# EAGLE board DrumidySynth (EAGLE 9.6.2), part 1 of 2
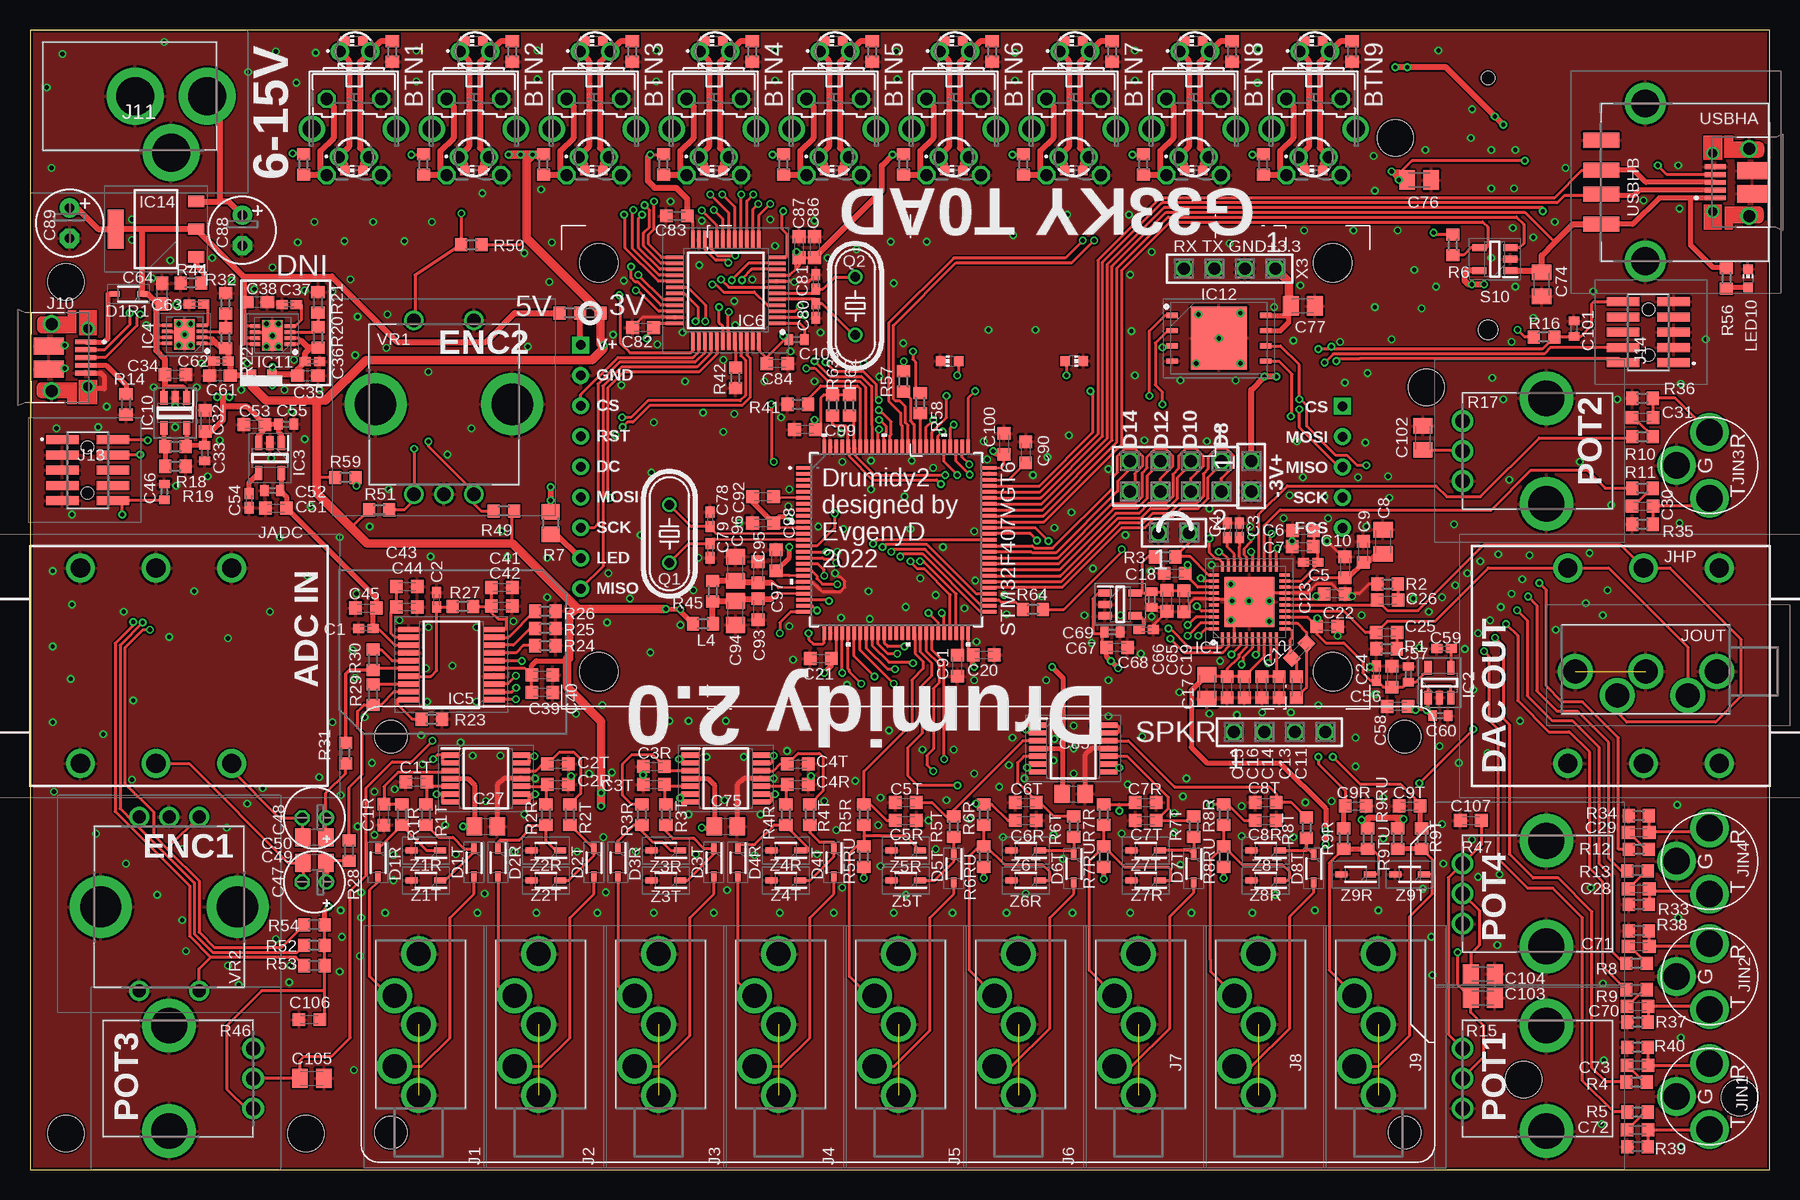
[diagram p6: board, top side]
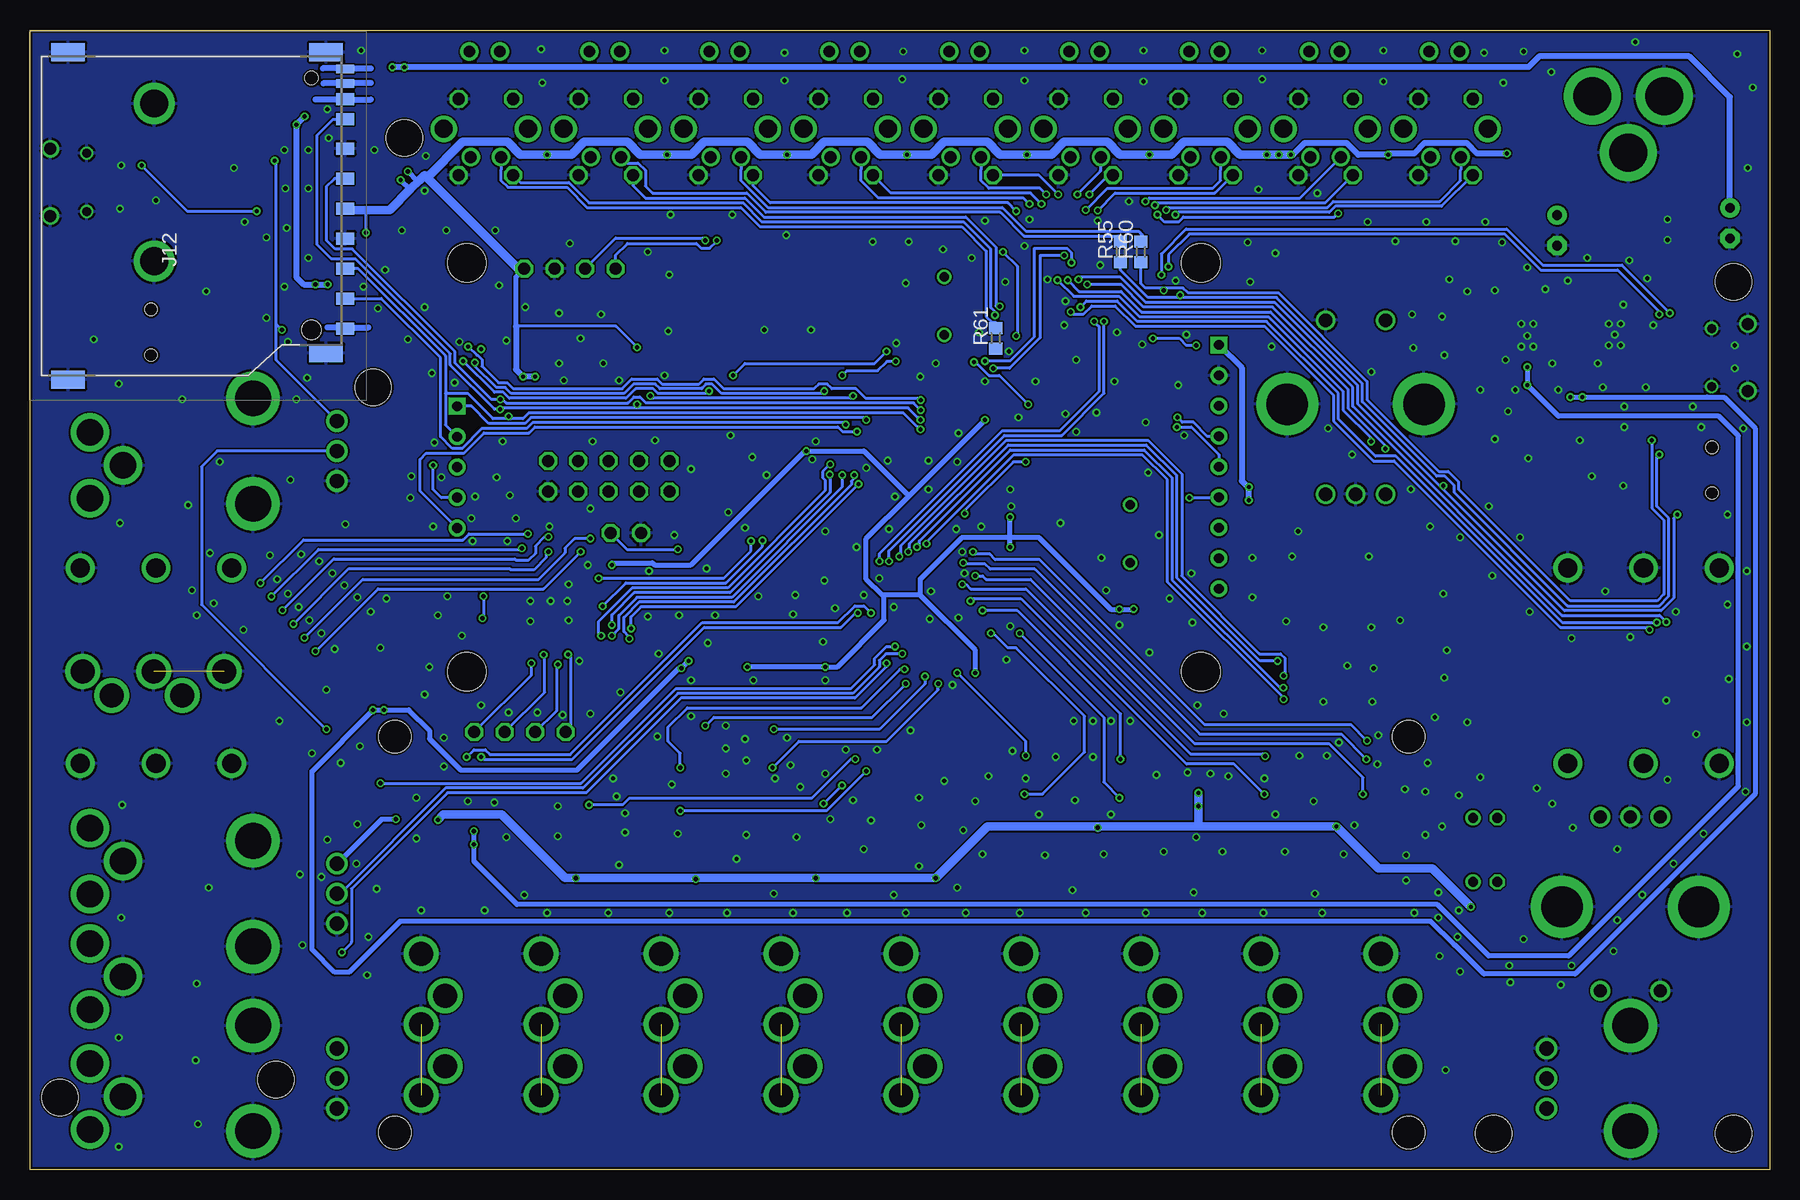
[diagram p7: board, bottom side, seen from below]

Size 145 x 95 mm. Coordinates in mm from the lower left corner, seen from the top.
Outline: 0,0 145,0 145,95 0,95 0,0
Copper layers (1*16): Top 0.018mm / dielectric 1.55mm / Bottom 0.018mm
Design rules "Multi-CB_2L_100µm-Tracks_OL35µmEVG *": minimum track width 0.1mm, minimum drill 0.2mm, track to track 0.15mm, track to pad 0.15mm, pad to pad 0.15mm, via to via 0.15mm, smd to smd 0mil, copper to edge 0.2mm, drill to drill 0.2mm, minimum pad ring 0.15mm, minimum via ring 0.15mm, stop-mask expansion 2mil, vias tented up to drill 0.45mm, thermal gap 0.2mm
Holes 3 mm at 3,3 23,3 142.5,6 124.5,7.5 116.4,65.2 113.8,86 3,74

## Footprints (pad centres in the part's own frame; a part is rotated, then mirrored left to right if it is on the bottom)
B3F-31XX = drill 1.016 octagon: A1 -2.261,-1.245; A2 -2.261,5.105; B1 2.261,-1.245; B2 2.261,5.105 | drill 1.499 pad 2.159: G1 -3.505,1.245; G2 3.505,1.245
C0402K = smd 0.925 x 0.74: 1 -0.6,0; 2 0.6,0
C0603K = smd 1.05 x 1.08: 1 -0.875,0; 2 0.875,0
C0805K = smd 1.3 x 1.6: 1 -1,0; 2 1,0
C0805 = smd 1.3 x 1.5: 1 -0.95,0; 2 0.95,0
C0402 = smd 0.7 x 0.9: 1 -0.65,0; 2 0.65,0
C0603 = smd 1.1 x 1: 1 -0.85,0; 2 0.85,0
E2-5 = drill 0.813 pad 1.27: + -1.016,0 | drill 0.813 pad 1.27 octagon: - 1.016,0
E2,5-6 = drill 0.813 pad 1.6: + -1.27,0 | drill 0.813 pad 1.6 octagon: - 1.27,0
SODFL2512X80N = smd 0.84 x 0.46: 1 -1.15,0; 2 1.15,0
QFN50P600X600X100-41N = smd 0.85 x 0.25: 1 -2.95,2.25; 2 -2.95,1.75; 3 -2.95,1.25; 4 -2.95,0.75; 5 -2.95,0.25; 6 -2.95,-0.25; 7 -2.95,-0.75; 8 -2.95,-1.25; 9 -2.95,-1.75; 10 -2.95,-2.25; 21 2.95,-2.25; 22 2.95,-1.75; 23 2.95,-1.25; 24 2.95,-0.75; 25 2.95,-0.25; 26 2.95,0.25; 27 2.95,0.75; 28 2.95,1.25; 29 2.95,1.75; 30 2.95,2.25 | smd 0.25 x 0.85: 11 -2.25,-2.95; 12 -1.75,-2.95; 13 -1.25,-2.95; 14 -0.75,-2.95; 15 -0.25,-2.95; 16 0.25,-2.95; 17 0.75,-2.95; 18 1.25,-2.95; 19 1.75,-2.95; 20 2.25,-2.95; 31 2.25,2.95; 32 1.75,2.95; 33 1.25,2.95; 34 0.75,2.95; 35 0.25,2.95; 36 -0.25,2.95; 37 -0.75,2.95; 38 -1.25,2.95; 39 -1.75,2.95; 40 -2.25,2.95 | smd 4.15 x 4.15: 41 0,0
SOT95P280X145-5N = smd 1.15 x 0.6: 1 -1.25,0.95; 2 -1.25,0; 3 -1.25,-0.95; 4 1.25,-0.95; 5 1.25,0.95
SON50P300X300X80-9N = smd 0.85 x 0.3: 1 -1.45,0.75; 2 -1.45,0.25; 3 -1.45,-0.25; 4 -1.45,-0.75; 5 1.45,-0.75; 6 1.45,-0.25; 7 1.45,0.25; 8 1.45,0.75 | smd 1.7 x 2.54: 9 0,0
SOP65P780X200-20N = smd 1.8 x 0.45: 1 -3.55,2.925; 2 -3.55,2.275; 3 -3.55,1.625; 4 -3.55,0.975; 5 -3.55,0.325; 6 -3.55,-0.325; 7 -3.55,-0.975; 8 -3.55,-1.625; 9 -3.55,-2.275; 10 -3.55,-2.925; 11 3.55,-2.925; 12 3.55,-2.275; 13 3.55,-1.625; 14 3.55,-0.975; 15 3.55,-0.325; 16 3.55,0.325; 17 3.55,0.975; 18 3.55,1.625; 19 3.55,2.275; 20 3.55,2.925
QFP50P900X900X160-48N = smd 1.475 x 0.3: 1 -4.238,2.75; 2 -4.238,2.25; 3 -4.238,1.75; 4 -4.238,1.25; 5 -4.238,0.75; 6 -4.238,0.25; 7 -4.238,-0.25; 8 -4.238,-0.75; 9 -4.238,-1.25; 10 -4.238,-1.75; 11 -4.238,-2.25; 12 -4.238,-2.75; 25 4.238,-2.75; 26 4.238,-2.25; 27 4.238,-1.75; 28 4.238,-1.25; 29 4.238,-0.75; 30 4.238,-0.25; 31 4.238,0.25; 32 4.238,0.75; 33 4.238,1.25; 34 4.238,1.75; 35 4.238,2.25; 36 4.238,2.75 | smd 0.3 x 1.475: 13 -2.75,-4.238; 14 -2.25,-4.238; 15 -1.75,-4.238; 16 -1.25,-4.238; 17 -0.75,-4.238; 18 -0.25,-4.238; 19 0.25,-4.238; 20 0.75,-4.238; 21 1.25,-4.238; 22 1.75,-4.238; 23 2.25,-4.238; 24 2.75,-4.238; 37 2.75,4.238; 38 2.25,4.238; 39 1.75,4.238; 40 1.25,4.238; 41 0.75,4.238; 42 0.25,4.238; 43 -0.25,4.238; 44 -0.75,4.238; 45 -1.25,4.238; 46 -1.75,4.238; 47 -2.25,4.238; 48 -2.75,4.238
SOP65P640X120-14N = smd 1.475 x 0.45: 1 -2.938,1.95; 2 -2.938,1.3; 3 -2.938,0.65; 4 -2.938,0; 5 -2.938,-0.65; 6 -2.938,-1.3; 7 -2.938,-1.95; 8 2.938,-1.95; 9 2.938,-1.3; 10 2.938,-0.65; 11 2.938,0; 12 2.938,0.65; 13 2.938,1.3; 14 2.938,1.95
SOT95P280X100-5N = smd 1.15 x 0.6: 1 -1.25,0.95; 2 -1.25,0; 3 -1.25,-0.95; 4 1.25,-0.95; 5 1.25,0.95
SON127P800X600X80-9N = smd 0.95 x 0.45: 1 -3.9,1.905; 2 -3.9,0.635; 3 -3.9,-0.635; 4 -3.9,-1.905; 5 3.9,-1.905; 6 3.9,-0.635; 7 3.9,0.635; 8 3.9,1.905 | smd 4.7 x 5.25: 9 0,0
SOT230P700X180-4N = smd 1.35 x 0.95: 1 -3.35,2.3; 2 -3.35,0; 3 -3.35,-2.3 | smd 1.35 x 3.25: 4 3.35,0
35RAPC2AVN4 = drill 2 pad 2.8: 1 6.096,5.588; 2 8.496,7.588; 3 14.396,7.588; 4 17.896,5.588; 5 11.996,5.588
AMPHENOL_10103594-0001LF = smd 0.4 x 1.75: 1 -1.3,2.825; 2 -0.65,2.825; 3 0,2.825; 4 0.65,2.825; 5 1.3,2.825 | drill 0.75 pad 1.05: 6 -2.425,3.03; 7 2.425,3.03 | drill 1: 8 -2.8,0; 9 2.8,0 | smd 1.425 x 2.5: S1 -0.963,-0.25; S2 0.963,-0.25
PRT00119 = drill 3.162 pad 4.743: 1 -5.664,-1.286; 2 0.336,-1.286; 3 -2.664,3.414
GSD090012SEU = smd 1 x 1.5: 1 6.875,12.275; 2 4.375,12.275; 3 1.875,12.275; 4 -0.625,12.275; 5 -3.125,12.275; 6 -5.625,12.275; 7 -8.05,12.275; 8 -9.75,12.275; 9 9.375,12.275 | smd 0.7 x 1.5: 10 -11.05,12.275; 11 -12.25,12.275 | smd 1.5 x 2.8: MP1 -13.65,10.675; MP2 11.451,10.675; MP3 -13.65,-10.825; MP4 13.65,-10.825 | hole 1.1: -11.499,9.475 | hole 1.6: 9.501,9.475
FTSH-105-XX-YYY-DV-K-A-P-TR = smd 0.74 x 2.7: 1 -2.54,-2.1; 2 -2.54,2.1; 3 -1.27,-2.1; 4 -1.27,2.1; 5 0,-2.1; 6 0,2.1; 7 1.27,-2.1; 8 1.27,2.1; 9 2.54,-2.1; 10 2.54,2.1 | hole 1.02: -1.905,0; 1.905,0
SJ63073E = drill 1.6 pad 2.4: 1 -6.3,-8.15; 2 0,-8.15; 3 6.3,-8.15; 4 -6.3,8.15; 5 0,8.15; 6 6.3,8.15
JACK35VERT = drill 2.2 pad 3.2: GND 0,2.75; RING 2.75,0; TIP -2.75,0
R0603 = smd 1 x 1.1: 1 -0.85,0; 2 0.85,0
CHIP-LED0603 = smd 0.8 x 0.8: A 0,-0.75; C 0,0.75
T-1(3MM)_2 = drill 0.98 pad 1.54: 1 -1.27,0; 2 1.27,0
HC49/S = drill 0.813: 1 -2.413,0; 2 2.413,0
R0805 = smd 1.3 x 1.5: 1 -0.95,0; 2 0.95,0
PTV09A4020FB103 = drill 1.2 pad 1.8: 1 -2.5,-5.6; 2 0,-5.6; 3 2.5,-5.6 | drill 2.973 pad 4.46: 4 -4.4,1.4; 5 4.4,1.4
SOT95P280X145-5N' = smd 1.15 x 0.6: 1 -1.3,0.95; 2 -1.3,0; 3 -1.3,-0.95; 4 1.3,-0.95; 5 1.3,0.95
LQFP100-14X14MM = smd 1.194 x 0.305: 1 -7.75,6; 2 -7.75,5.5; 3 -7.75,5; 4 -7.75,4.5; 5 -7.75,4; 6 -7.75,3.5; 7 -7.75,3; 8 -7.75,2.5; 9 -7.75,2; 10 -7.75,1.5; 11 -7.75,1; 12 -7.75,0.5; 13 -7.75,0; 14 -7.75,-0.5; 15 -7.75,-1; 16 -7.75,-1.5; 17 -7.75,-2; 18 -7.75,-2.5; 19 -7.75,-3; 20 -7.75,-3.5; 21 -7.75,-4; 22 -7.75,-4.5; 23 -7.75,-5; 24 -7.75,-5.5; 25 -7.75,-6; 51 7.75,-6; 52 7.75,-5.5; 53 7.75,-5; 54 7.75,-4.5; 55 7.75,-4; 56 7.75,-3.5; 57 7.75,-3; 58 7.75,-2.5; 59 7.75,-2; 60 7.75,-1.5; 61 7.75,-1; 62 7.75,-0.5; 63 7.75,0; 64 7.75,0.5; 65 7.75,1; 66 7.75,1.5; 67 7.75,2; 68 7.75,2.5; 69 7.75,3; 70 7.75,3.5; 71 7.75,4; 72 7.75,4.5; 73 7.75,5; 74 7.75,5.5; 75 7.75,6 | smd 0.305 x 1.194: 26 -6,-7.75; 27 -5.5,-7.75; 28 -5,-7.75; 29 -4.5,-7.75; 30 -4,-7.75; 31 -3.5,-7.75; 32 -3,-7.75; 33 -2.5,-7.75; 34 -2,-7.75; 35 -1.5,-7.75; 36 -1,-7.75; 37 -0.5,-7.75; 38 0,-7.75; 39 0.5,-7.75; 40 1,-7.75; 41 1.5,-7.75; 42 2,-7.75; 43 2.5,-7.75; 44 3,-7.75; 45 3.5,-7.75; 46 4,-7.75; 47 4.5,-7.75; 48 5,-7.75; 49 5.5,-7.75; 50 6,-7.75; 76 6,7.75; 77 5.5,7.75; 78 5,7.75; 79 4.5,7.75; 80 4,7.75; 81 3.5,7.75; 82 3,7.75; 83 2.5,7.75; 84 2,7.75; 85 1.5,7.75; 86 1,7.75; 87 0.5,7.75; 88 0,7.75; 89 -0.5,7.75; 90 -1,7.75; 91 -1.5,7.75; 92 -2,7.75; 93 -2.5,7.75; 94 -3,7.75; 95 -3.5,7.75; 96 -4,7.75; 97 -4.5,7.75; 98 -5,7.75; 99 -5.5,7.75; 100 -6,7.75
JUMPERWIDE = smd 0.8 x 1: P$1 -1.37,0; P$2 0.37,0
TFTQVGA = drill 0.8 pad 1.4: CS 65.7,14.94; CS_F 2.2,25.12; DC 65.7,20.02; GND 65.7,12.4; LED 65.7,27.64; MISO 65.7,30.18; MISO_SD 2.2,20.04; MOSI 65.7,22.56; MOSI_SD 2.2,17.5; RST 65.7,17.48; SCK 65.7,25.1; SCK_SD 2.2,22.58 | drill 0.8 pad 1.4 square: CS_SD 2.2,14.96; VDD 65.7,9.86 | hole 3.2: 3,3; 3,37.1; 64.2,3; 64.2,37.1
EPAPERLCDNOPIN = hole 2.7: 2.5,2.5; 2.5,35.5; 87,2.5; 87,35.5
2923037 = smd 3 x 1.25: 1 6.23,3.5; 2 6.23,1; 3 6.23,-1; 4 6.23,-3.5 | drill 2.3 pad 3.45: 5 2.55,6.57; 6 2.55,-6.57
PEC11R4220FS0024 = drill 1.1 pad 1.65: 1 0,0; 2 5,0; A1 0,-14.5; B1 5,-14.5; C1 2.5,-14.5 | drill 3.441 pad 5.161: MH1 -3.2,-7; MH2 8.2,-7
SSW-104-02-G-S = drill 1 pad 1.5 octagon: 1 -3.81,0; 2 -1.27,0; 3 1.27,0; 4 3.81,0
SSW-102-02-G-S = drill 1 pad 1.5 octagon: 1 -1.27,0; 2 1.27,0
SSW-104-02-G-D = drill 1 pad 1.5 octagon: 1 -3.81,-1.27; 2 -3.81,1.27; 3 -1.27,-1.27; 4 -1.27,1.27; 5 1.27,-1.27; 6 1.27,1.27; 7 3.81,-1.27; 8 3.81,1.27
SOD2512X110N = smd 1 x 0.5: 1 -1.2,0; 2 1.2,0

## Placement (x,y rotation side)
BTN1  [B3F-31XX]  27,88 180 top
BTN2  [B3F-31XX]  37,88 180 top
BTN3  [B3F-31XX]  47,88 180 top
BTN4  [B3F-31XX]  57,88 180 top
BTN5  [B3F-31XX]  67,88 180 top
BTN6  [B3F-31XX]  77,88 180 top
BTN7  [B3F-31XX]  87,88 180 top
BTN8  [B3F-31XX]  97,88 180 top
BTN9  [B3F-31XX]  107,88 180 top
C1  10n  [C0402K]  28,45.1 180 top
C1R  10n  [C0603K]  29.5,29.6 270 top
C1T  10n  [C0603K]  32.2,32.3 180 top
C2  10n  [C0402K]  33.9,47.5 90 top
C2R  10n  [C0603K]  44,32.1 0 top
C2T  10n  [C0603K]  44,33.8 0 top
C3  150pF  [C0402K]  100.8,53.3 90 top
C3R  10n  [C0603K]  52,33.6 180 top
C3T  10n  [C0603K]  52,32.1 180 top
C4  150pF  [C0402K]  99.8,53.3 90 top
C4R  10n  [C0603K]  64,32.1 0 top
C4T  10n  [C0603K]  64,33.8 0 top
C5  10n  [C0402K]  106.76,50.63 180 top
C5R  10n  [C0603K]  73,29.1 0 top
C5T  10n  [C0603K]  73,30.6 180 top
C6  100n  [C0603K]  106.14,53.29 180 top
C6R  10n  [C0603K]  83,29.1 0 top
C6T  10n  [C0603K]  83,30.6 180 top
C7  1u  [C0603K]  106.09,51.93 180 top
C7R  10n  [C0603K]  93,30.6 0 top
C7T  10n  [C0603K]  93,29.1 180 top
C8  10u  [C0805K]  112.79,52.34 90 top
C8R  10n  [C0603K]  103,29.1 0 top
C8T  10n  [C0603K]  103,30.6 180 top
C9  1u  [C0603K]  111.13,51.5 90 top
C9R  10n  [C0603K]  110.5,30.3 0 top
C9T  10n  [C0603K]  115,30.3 180 top
C10  100n  [C0603K]  109.61,50.22 90 top
C11  1u  [C0603K]  105.57,40.22 270 top
C12  1u  [C0603K]  105.79,43.25 45 top
C13  1u  [C0603K]  104.12,40.22 270 top
C14  100n  [C0603K]  102.68,40.22 270 top
C15  100n  [C0603K]  99.79,40.22 270 top
C16  100n  [C0603K]  101.23,40.22 270 top
C17  10u  [C0805K]  98.11,40.25 270 top
C18  100n  [C0603K]  95.4,49.71 180 top
C19  100n  [C0603K]  96.19,47.38 270 top
C20  100n  [C0603K]  79.5,42.9 0 top
C21  100n  [C0603K]  65.9,42.6 180 top
C22  100n  [C0603K]  108.14,45.29 0 top
C23  100n  [C0603K]  108.76,47.99 0 top
C24  10n  [C0402K]  112.23,41.38 90 top
C25  22n  [C0603K]  113.07,44.77 0 top
C26  22n  [C0603K]  113.16,47.47 0 top
C27  100n  [C0805]  38,28.6 0 top
C28  1u  [C0603K]  134.1,23.4 0 top
C29  1u  [C0603K]  134.1,28.1 0 top
C30  1u  [C0603K]  134.4,55.3 0 top
C31  1u  [C0603K]  134.4,62.7 0 top
C32  4u7  [C0603K]  14.61,62.42 270 top
C33  100n  [C0402]  14.57,59.72 90 top
C34  4u7  [C0603K]  12.11,66.29 180 top
C35  10u  [C0603]  23.15,66.18 0 top
C36  100n  [C0402K]  23.55,67.35 0 top
C37  4n7  [C0402K]  21.61,72.1 180 top
C38  10uF  [C0603]  18.94,72.32 0 top
C39  100n  [C0603K]  42.7,39.79 0 top
C40  10u  [C0603K]  42.7,41.23 0 top
C41  100n  [C0603K]  39.33,48.52 0 top
C42  10u  [C0603K]  39.33,46.98 0 top
C43  100n  [C0603K]  31.4,48.6 0 top
C44  10u  [C0603K]  31.4,46.9 0 top
C45  100n  [C0603K]  28,46.8 180 top
C46  0.1uF  [C0402]  11.2,56.5 90 top
C47  [E2-5]  23.7,23.97 180 top
C48  [E2-5]  23.7,29.32 180 top
C49  10u  [C0805]  23.7,25.58 180 top
C50  10u  [C0805]  23.7,27.68 180 top
C51  4u7  [C0603K]  20.5,55.13 0 top
C52  100n  [C0402]  20.2,56.6 0 top
C53  4u7  [C0603K]  18.7,62.12 0 top
C54  10n  [C0402K]  18.26,55.77 90 top
C55  100n  [C0402]  21.35,62.14 180 top
C56  4u7  [C0603K]  113.53,41.09 270 top
C57  100n  [C0402]  114.9,41.29 270 top
C58  4u7  [C0603K]  114.01,38.62 0 top
C59  10n  [C0402K]  117.87,43.43 0 top
C60  100n  [C0402]  117.55,37.83 180 top
C61  10u  [C0603]  15.83,66.17 180 top
C62  100n  [C0402K]  15.93,67.4 180 top
C63  4n7  [C0402K]  13.89,72.15 180 top
C64  10uF  [C0603]  11.03,73.02 90 top
C65  4u7  [C0603K]  94.78,47.41 90 top
C66  100n  [C0402]  93.51,47.51 90 top
C67  4u7  [C0603K]  90.61,43.54 180 top
C68  DNI  [C0402K]  93.06,45.03 180 top
C69  100n  [C0402]  90.21,44.81 180 top
C70  1u  [C0603K]  134,13.6 0 top
C71  1u  [C0603K]  134.1,18.6 0 top
C72  1u  [C0603K]  134,3.3 0 top
C73  1u  [C0603K]  134,8.7 0 top
C74  10u  [C0805K]  126,73.8 270 top
C75  100n  [C0805]  58,28.6 0 top
C76  2u2  [C0805K]  115.8,82.5 0 top
C77  2u2  [C0805K]  106.1,72 0 top
C78  20p  [C0402K]  56.7,54.2 90 top
C79  20p  [C0402K]  56.7,51.6 270 top
C80  20p  [C0402K]  65.5,71.6 270 top
C81  20p  [C0402K]  65.5,74 90 top
C82  100n  [C0603K]  51.1,70.2 180 top
C83  100n  [C0603K]  53.9,79.5 180 top
C84  100n  [C0603K]  62.3,67.2 180 top
C85  100n  [C0805]  87,31.3 0 top
C86  100n  [C0603K]  65.4,76.9 270 top
C87  100n  [C0603K]  64.1,76.9 270 top
C88  10u  [E2,5-6]  17.7,78.3 270 top
C89  100u  [E2,5-6]  3.3,78.9 270 top
C90  2u2  [C0603K]  83,59.8 270 top
C91  2u2  [C0603K]  77.3,42 90 top
C92  100nF  [C0603K]  61.1,56.1 0 top
C93  100n  [C0603K]  60.7,46.7 270 top
C94  1u  [C0805K]  58.8,46.4 270 top
C95  100n  [C0603K]  60.7,49.8 90 top
C96  1u  [C0805K]  58.8,50.1 90 top
C97  100n  [C0603K]  62.2,50.8 90 top
C98  100n  [C0603K]  61.1,53.9 180 top
C99  100n  [C0603K]  64.6,61.7 180 top
C100  100n  [C0603K]  81.2,60.5 90 top
C101  0.1uF  [C0402]  128.7,70.1 90 top
C102  2u2  [C0805K]  116.1,61 90 top
C103  2u2  [C0805K]  121.1,14.3 0 top
C104  2u2  [C0805K]  121.1,16.3 0 top
C105  2u2  [C0805K]  23.5,7.6 0 top
C106  100n  [C0603K]  23.3,12.5 0 top
C107  100n  [C0603K]  120.1,29.1 0 top
C108  0.1uF  [C0402]  63.9,69.2 0 top
D1R  BAT54J,115  [SODFL2512X80N]  29,25.6 270 top
D1R1  BAT54J,115  [SODFL2512X80N]  8.2,73 180 top
D1T  BAT54J,115  [SODFL2512X80N]  37,25.6 270 top
D2R  BAT54J,115  [SODFL2512X80N]  39,25.6 270 top
D2T  BAT54J,115  [SODFL2512X80N]  47,25.6 270 top
D3R  BAT54J,115  [SODFL2512X80N]  49,25.6 270 top
D3T  BAT54J,115  [SODFL2512X80N]  57,25.6 270 top
D4R  BAT54J,115  [SODFL2512X80N]  59,25.6 270 top
D4T  BAT54J,115  [SODFL2512X80N]  67,25.6 270 top
D5T  BAT54J,115  [SODFL2512X80N]  77,25.1 270 top
D6T  BAT54J,115  [SODFL2512X80N]  87,25.1 270 top
D7T  BAT54J,115  [SODFL2512X80N]  97,25.1 270 top
D8T  BAT54J,115  [SODFL2512X80N]  107,25.1 270 top
IC1  CS43L22-CNZR  [QFN50P600X600X100-41N]  101.64,47.31 90 top
IC2  LD3985M25R  [SOT95P280X145-5N]  117.49,40.59 90 top
IC3  LD3985M33R  [SOT95P280X145-5N]  20,59.31 270 top
IC4  ADM7170ACPZ-3.3-R7  [SON50P300X300X80-9N]  12.89,69.61 180 top
IC5  WM8782SEDS_RV  [SOP65P780X200-20N]  35.13,42.1 180 top
IC6  STM32F103C8T6TR  [QFP50P900X900X160-48N]  58,73.3 180 top
IC7  MCP6004-I_ST  [SOP65P640X120-14N]  38,32.6 0 top
IC8  TPS76925DBVR  [SOT95P280X145-5N]  90.87,47.11 0 top
IC9  MCP6004-I_ST  [SOP65P640X120-14N]  58,32.6 0 top
IC10  ADP123AUJZ-R7  [SOT95P280X100-5N]  12.11,63.08 270 top
IC11  ADM7170ACPZ-3.3-R7  [SON50P300X300X80-9N]  20.21,69.56 180 top
IC12  W25Q512JVEIQ  [SON127P800X600X80-9N]  99.1,69.3 0 top
IC13  MCP6004-I_ST  [SOP65P640X120-14N]  86.95,35.1 0 top
IC14  LT1117IST  [SOT230P700X180-4N]  10.5,78.4 180 top
J1  [35RAPC2AVN4]  38,0.1 90 top
J2  [35RAPC2AVN4]  48,0.1 90 top
J3  [35RAPC2AVN4]  58,0.1 90 top
J4  [35RAPC2AVN4]  68,0.1 90 top
J5  [35RAPC2AVN4]  78,0.1 90 top
J6  [35RAPC2AVN4]  88,0.1 90 top
J7  [35RAPC2AVN4]  98,0.1 90 top
J8  [35RAPC2AVN4]  108,0.1 90 top
J9  [35RAPC2AVN4]  118,0.1 90 top
J10  10103594-0001LF  [AMPHENOL_10103594-0001LF]  1.8,67.7 270 top
J11  DC-JACK  [PRT00119]  9.1,88.2 180 top
J12  GSD090012SEU  [GSD090012SEU]  131,79.5 270 bottom
J13  FTSH-105-01-F-DV-K-A-P-TR  [FTSH-105-XX-YYY-DV-K-A-P-TR]  4.8,58.3 270 top
J14  FTSH-105-01-F-DV-K-A-P-TR  [FTSH-105-XX-YYY-DV-K-A-P-TR]  134.9,69.8 90 top
JADC  SJ-63073E  [SJ63073E]  10.5,42 0 top
JHP  [35RAPC2AVN4]  146.7,47.1 180 top
JIN1  JACK35VERT  [JACK35VERT]  140,6.1 90 top
JIN2  JACK35VERT  [JACK35VERT]  140,16.1 90 top
JIN3  JACK35VERT  [JACK35VERT]  140,58.7 90 top
JIN4  JACK35VERT  [JACK35VERT]  140,25.7 90 top
JOUT  SJ-63073E  [SJ63073E]  134.5,42 180 top
L4  fcm1608-0603  [R0603]  56.1,45.5 180 top
LED10  [CHIP-LED0603]  143.2,74.3 0 top
LED11  [CHIP-LED0603]  76.65,67.4 90 top
LED12  [CHIP-LED0603]  87.05,67.4 270 top
LEDA1  L-934HD  [T-1(3MM)_2]  27.1,93.2 0 top
LEDA3  L-934HD  [T-1(3MM)_2]  37.1,93.2 0 top
LEDA5  L-934HD  [T-1(3MM)_2]  47.1,93.2 0 top
LEDA7  L-934HD  [T-1(3MM)_2]  57.1,93.2 0 top
LEDA9  L-934HD  [T-1(3MM)_2]  67.1,93.2 0 top
LEDA11  L-934HD  [T-1(3MM)_2]  77.1,93.2 0 top
LEDA13  L-934HD  [T-1(3MM)_2]  87.1,93.2 0 top
LEDA15  L-934HD  [T-1(3MM)_2]  97.1,93.2 0 top
LEDA17  L-934HD  [T-1(3MM)_2]  107.1,93.2 0 top
LEDB1  [CHIP-LED0603]  27,94.1 90 top
LEDB3  [CHIP-LED0603]  37,94.1 90 top
LEDB5  [CHIP-LED0603]  47,94.1 90 top
LEDB7  [CHIP-LED0603]  57,94.1 90 top
LEDB9  [CHIP-LED0603]  67,94.1 90 top
LEDB11  [CHIP-LED0603]  77,94.1 90 top
LEDB13  [CHIP-LED0603]  87,94.1 90 top
LEDB15  [CHIP-LED0603]  97,94.1 90 top
LEDB17  [CHIP-LED0603]  107,94.1 90 top
LEDC1  L-934HD  [T-1(3MM)_2]  27,84.4 0 top
LEDC3  L-934HD  [T-1(3MM)_2]  37,84.4 0 top
LEDC5  L-934HD  [T-1(3MM)_2]  47,84.4 0 top
LEDC7  L-934HD  [T-1(3MM)_2]  57,84.4 0 top
LEDC9  L-934HD  [T-1(3MM)_2]  67,84.4 0 top
LEDC11  L-934HD  [T-1(3MM)_2]  77,84.4 0 top
LEDC13  L-934HD  [T-1(3MM)_2]  87,84.4 0 top
LEDC15  L-934HD  [T-1(3MM)_2]  97,84.4 0 top
LEDC17  L-934HD  [T-1(3MM)_2]  107,84.4 0 top
LEDD1  [CHIP-LED0603]  27,83.3 90 top
LEDD3  [CHIP-LED0603]  37,83.3 90 top
LEDD5  [CHIP-LED0603]  47,83.3 90 top
LEDD7  [CHIP-LED0603]  57,83.3 90 top
LEDD9  [CHIP-LED0603]  67,83.3 90 top
LEDD11  [CHIP-LED0603]  77,83.3 90 top
LEDD13  [CHIP-LED0603]  87,83.3 90 top
LEDD15  [CHIP-LED0603]  97,83.3 90 top
LEDD17  [CHIP-LED0603]  107,83.3 90 top
Q1  [HC49/S]  53.3,53 90 top
Q2  [HC49/S]  68.8,72 270 top
R1  51  [R0603]  113.07,43.41 0 top
R1R  1k  [R0603]  31,29.6 270 top
R1T  1k  [R0603]  33,29.6 270 top
R2  51  [R0603]  113.16,48.81 0 top
R2R  1k  [R0603]  43,29.6 270 top
R2T  1k  [R0603]  45,29.6 270 top
R3  10k  [R0603]  94.62,51.09 180 top
R3R  1k  [R0603]  51,29.6 270 top
R3T  1k  [R0603]  53,29.6 270 top
R4  100  [R0603]  133.9,7.3 180 top
R4R  1k  [R0603]  63,29.6 270 top
R4T  1k  [R0603]  65,29.6 270 top
R5  100  [R0603]  134,4.8 180 top
R5R  1k  [R0603]  69.5,29.6 270 top
R5RU  10k  [R0603]  69.5,26.1 90 top
R5T  1k  [R0603]  77,28.6 270 top
R6  10k  [R0603]  118.6,77.1 270 top
R6R  1k  [R0603]  79.5,29.6 270 top
R6RU  10k  [R0603]  79.5,26.1 90 top
R6T  1k  [R0603]  87,28.6 270 top
R7  [R0805]  43.4,53.9 270 top
R7R  1k  [R0603]  89.5,29.6 270 top
R7RU  10k  [R0603]  89.5,26.1 90 top
R7T  1k  [R0603]  97,28.6 270 top
R8  100  [R0603]  133.9,17.2 180 top
R8R  1k  [R0603]  99.5,29.6 270 top
R8RU  10k  [R0603]  99.5,26.1 90 top
R8T  1k  [R0603]  106.4,28.5 270 top
R9  100  [R0603]  133.9,15 180 top
R9R  1k  [R0603]  109.5,27.6 270 top
R9RU  10k  [R0603]  111.5,27.6 270 top
R9T  1k  [R0603]  116,27.6 270 top
R9TU  10k  [R0603]  114,27.6 270 top
R10  100  [R0603]  134.4,61.1 180 top
R11  100  [R0603]  134.4,56.8 180 top
R12  100  [R0603]  134.1,26.7 180 top
R13  100  [R0603]  134,24.9 180 top
R14  10k  [R0603]  8,63.8 90 top
R15  PTV09A-4025U-B103  [PTV09A4020FB103]  125,7.6 270 top
R16  10k  [R0603]  126.2,69.4 180 top
R17  PTV09A-4025U-B103  [PTV09A4020FB103]  125,59.9 270 top
R18  150k  [R0603]  12.14,60.27 180 top
R19  21k  [R0603]  12.11,58.63 0 top
R20  0k  [R0603]  24.02,69.36 90 top
R21  DNI  [R0603]  24,72.28 90 top
R22  0k  [R0603]  16.3,69.31 90 top
R23  10k  [R0603]  33.49,37.55 0 top
R24  DNI  [R0603]  42.95,43.67 180 top
R25  0k  [R0603]  42.95,45.11 180 top
R26  DNI  [R0603]  42.95,46.55 180 top
R27  3k3  [R0603]  36.07,46.95 0 top
R28  10k  [R0603]  26.6,26.6 90 top
R29  10k  [R0603]  28.6,39.6 90 top
R30  10k  [R0603]  28.6,42.5 270 top
R31  10k  [R0603]  26.3,34.7 90 top
R32  DNI  [R0603]  16.3,72.2 90 top
R33  100k  [R0603]  134.1,22.1 0 top
R34  100k  [R0603]  134.1,29.5 0 top
R35  100k  [R0603]  134.4,53.8 0 top
R36  100k  [R0603]  134.4,64.3 0 top
R37  100k  [R0603]  134,12.3 0 top
R38  100k  [R0603]  134.1,19.9 0 top
R39  100k  [R0603]  134,1.9 0 top
R40  100k  [R0603]  134,10.2 0 top
R41  10k  [R0603]  64,63.8 180 top
R42  10k  [R0603]  58.8,66 90 top
R43  3V3  [R0603]  46.7,71.4 180 top
R44  0k  [R0603]  13.4,73.9 0 top
R45  47E  [R0603]  56.9,48.2 90 top
R46  PTV09A-4025U-B103  [PTV09A4020FB103]  13,7.6 90 top
R47  PTV09A-4025U-B103  [PTV09A4020FB103]  125,23 270 top
R48  5V  [R0603]  45,71.4 0 top
R49  10k  [R0603]  39.5,54.9 180 top
R50  10k  [R0603]  36.8,77.1 180 top
R51  10k  [R0603]  29.1,55 0 top
R52  10k  [R0603]  23.7,18.7 180 top
R53  10k  [R0603]  23.7,17 180 top
R54  10k  [R0603]  23.7,20.4 180 top
R55  0  [R0603]  54.1,76.5 90 bottom
R56  10k  [R0603]  141.4,74.3 270 top
R57  10k  [R0603]  72.8,65.7 90 top
R58  10k  [R0603]  74.2,63.9 90 top
R59  10k  [R0603]  26.3,57.7 180 top
R60  0  [R0603]  52.4,76.5 90 bottom
R61  0  [R0603]  64.5,69.3 90 bottom
R62  10k  [R0603]  68.3,63.7 270 top
R63  10k  [R0603]  66.9,63.7 270 top
R64  0  [R0603]  83.6,46.7 180 top
RBTN1  10k  [R0603]  22.8,83.8 270 top
RBTN3  10k  [R0603]  32.8,83.8 270 top
RBTN5  10k  [R0603]  42.8,83.8 270 top
RBTN7  10k  [R0603]  52.8,83.8 270 top
RBTN9  10k  [R0603]  62.8,83.8 270 top
RBTN11  10k  [R0603]  72.8,83.8 270 top
RBTN13  10k  [R0603]  82.8,83.8 270 top
RBTN15  10k  [R0603]  92.8,83.8 270 top
RBTN17  10k  [R0603]  102.8,83.8 270 top
RLED1  1k  [R0603]  30.2,93.2 270 top
RLED3  1k  [R0603]  40.2,93.2 270 top
RLED5  1k  [R0603]  50.2,93.2 270 top
RLED7  1k  [R0603]  60.2,93.2 270 top
RLED9  1k  [R0603]  70.2,93.2 270 top
RLED11  1k  [R0603]  80.2,93.2 270 top
RLED13  1k  [R0603]  90.2,93.2 270 top
RLED15  1k  [R0603]  100.2,93.2 270 top
RLED17  1k  [R0603]  110.2,93.2 270 top
S10  STMPS2141STR  [SOT95P280X145-5N']  122.1,75.9 180 top
U1  STM32F407VGT6  [LQFP100-14X14MM]  72.2,52.5 0 top
U$1  JUMPERSMD  [JUMPERWIDE]  19.81,66.17 0 top
U$2  TFT-SD  [TFTQVGA]  111.6,78.6 180 top
U$3  EPAPER2.9  [EPAPERLCDNOPIN]  117.1,38.6 180 top
USBHA  10103594-0001LF  [AMPHENOL_10103594-0001LF]  143.3,82.3 90 top
USBHB  USB-A(292303-7)  [2923037]  137.2,82.3 180 top
VR1  PEC11R-4220F-S0024  [PEC11R4220FS0024]  32,70.8 0 top
VR2  PEC11R-4220F-S0024  [PEC11R4220FS0024]  14.1,14.9 180 top
X1  SSW-104-02-G-S  [SSW-104-02-G-S]  104.15,36.46 0 top
X2  SSW-102-02-G-S  [SSW-102-02-G-S]  95.35,53.08 0 top
X3  SSW-104-02-G-S  [SSW-104-02-G-S]  100,75.1 180 top
X4  SSW-104-02-G-D  [SSW-104-02-G-D]  95.5,57.8 180 top
X5  SSW-102-02-G-S  [SSW-102-02-G-S]  101.8,57.8 270 top
Z1R  MM3Z3V3T1G  [SOD2512X110N]  33,26.6 180 top
Z1T  MM3Z3V3T1G  [SOD2512X110N]  33,24.1 180 top
Z2R  MM3Z3V3T1G  [SOD2512X110N]  43,26.6 180 top
Z2T  MM3Z3V3T1G  [SOD2512X110N]  43,24.1 180 top
Z3R  MM3Z3V3T1G  [SOD2512X110N]  53,26.6 180 top
Z3T  MM3Z3V3T1G  [SOD2512X110N]  53,24.1 180 top
Z4R  MM3Z3V3T1G  [SOD2512X110N]  63,26.6 180 top
Z4T  MM3Z3V3T1G  [SOD2512X110N]  63,24.1 180 top
Z5R  MM3Z3V3T1G  [SOD2512X110N]  73,26.6 180 top
Z5T  MM3Z3V3T1G  [SOD2512X110N]  73,24.1 180 top
Z6R  MM3Z3V3T1G  [SOD2512X110N]  83,24.1 180 top
Z6T  MM3Z3V3T1G  [SOD2512X110N]  83,26.6 180 top
Z7R  MM3Z3V3T1G  [SOD2512X110N]  93,24.1 180 top
Z7T  MM3Z3V3T1G  [SOD2512X110N]  93,26.6 180 top
Z8R  MM3Z3V3T1G  [SOD2512X110N]  103,24.1 180 top
Z8T  MM3Z3V3T1G  [SOD2512X110N]  103,26.6 180 top
Z9R  MM3Z3V3T1G  [SOD2512X110N]  110.5,24.6 180 top
Z9T  MM3Z3V3T1G  [SOD2512X110N]  115,24.6 180 top

## Tracks (layer width: path | path; a pad name or v marks a point on that pad's centre or on a via)
2V5A  (via drill 0.35)
  Top 0.25: IC1.16 107.45,47.56 C23.1 107.69,47.8 v107.2,47.8 | IC1.13 106.5,46.06 107.23,45.33 | 107.23,45.33 C22.1 107.27,44.63 108,43.9 109.5,43.9 111.1,42.3 111.1,41.4 111.72,40.78 C24.1 112.8,40.22 C56.2 114.47,40.22 C57.2 115.54,40.64 116.54,41.64 IC2.5 | v107.3,45.96 107.23,45.89 107.23,45.33
  Bottom 0.25: v107.2,47.8 107.2,46.06 v107.3,45.96
2V5D
  Top 0.25: IC8.5 92.7,48.06 | 92.7,48.06 93.41,48.06 C66.2 94.66,48.16 C65.2 96.16,48.28 C19.1 96.39,48.06 IC1.34 | R3.2 93.19,51.09 92.7,50.6 92.7,48.06
3V3A
  Top 0.25: IC5.13 30.38,43.73 29,45.1 C1.1
  Top 0.4: IC3.5 20.95,56.7 C52.2 21.38,56.08 C51.2 28.88,47.63 C45.1 28.6,46.52 C1.1
3V3D  (via drill 0.35)
  Top 0.25: IC5.5 41.26,41.77 C40.1 C39.1 | IC4.2 15.04,69.36 15.2,69.2 | IC4.1 15.26,68.86 15.4,69 | IC1.33 97.34,48.56 96.28,49.62 C18.1 | IC6.36 52.33,70.55 C82.1 51.98,70.08 51.4,69.5 v51.4,69.3 | R54.1 R52.1 R53.1 24.55,14.9 | IC6.24 55.25,79.03 C83.1 | 63.84,75.06 64.1,75.33 C87.2 C86.2 | 63.84,75.06 63.33,74.55 IC6.9 | C106.2 24.55,12.88 24.55,14.9 | RBTN1.1 21.95,84.65 v21.9,84.7 | v31.8,84.6 32.75,84.6 RBTN3.1 | 42.5,84.65 RBTN5.1 | v51.7,84.6 52.75,84.6 RBTN7.1 | v61.9,84.6 61.95,84.65 RBTN9.1 | v71.9,84.6 71.95,84.65 RBTN11.1 | v81.9,84.6 81.95,84.65 RBTN13.1 | v91.9,84.6 92.75,84.6 RBTN15.1 | v101.9,84.6 102.75,84.6 RBTN17.1 | U1.11 62.35,53.52 C98.1 | U1.19 63.3,49.51 62.6,49.52 C97.1 | U1.28 67.18,43.01 C21.1 | U1.75 80.92,58.52 81.2,58.8 C100.1 | U1.100 66.17,61.05 65.53,61.7 C99.1 | R62.1 R63.1 66.15,64.55 65.9,64.3 65.9,62.01 65.59,61.7 C99.1 | C20.1 78.55,42.88 78.2,42.77 U1.50 | C107.2 120.97,27.07 R47.1 118.22,24.32 118.22,11.28 R15.1 | R46.1 18,5.1 16.4,6.7 16.4,12 19.3,14.9 24.55,14.9 | R6.1 117.15,77.95 v117,78.1 | C99.1 65.47,62.42 v65.4,62.5 | IC6.48 60.75,68.28 61.42,67.6 C84.2 61.42,67.72 62.9,69.2 63.1,69.2 | C108.1 63.1,69.2 | 63.84,75.06 63.84,76.44 v63.9,76.5 | v62.8,69.5 63.1,69.2 | R51.1 26.85,53.6 26.85,53.45 | R59.2 23.9,57.7 | R49.1 40.15,54.7 40.15,52.2 | R50.1 40.85,77.1 41.4,77.65 | IC12.3 94.5,68.67 94.4,68.56 v94.4,68.55 | v124.6,84.1 115.2,84.1 114.2,83.1 | 52.6,46.72 52.98,46.72 53,46.7 | R16.2 124.6,69.4 v124,70
  Top 0.4: IC7.4 36.5,32.6 37.05,32.05 C27.1 v36.1,28.6 | IC9.4 56.5,32.6 57.05,32.05 C75.1 56.95,28.5 v56,28.5 | IC13.4 85.9,35.1 | 85.9,35.1 86.1,35.1 86.1,41 v85.2,41.9 | C85.1 86.05,34.95 85.9,35.1 | v69.5,24.3 R5RU.1 | v79.5,24.3 R6RU.1 | v89.5,24.2 R7RU.1 | v99.5,24.3 R8RU.1 | v78.7,41.9 78.55,42.05 78.55,42.88 | C100.1 80.58,59.62 v80.3,59.9 | C21.1 66.78,41.98 v66.2,41.4 | C97.1 63.3,51.02 v63.3,51.91 | v63.3,54.4 62.48,54.4 C98.1 60.23,55.65 C92.1 | L4.2 54.2,46.55 v54.2,46.7 53,46.7 | v114.1,82.5 C76.1 114.2,82.5 | 104.9,71.4 104.9,71.8 104.95,71.85 C77.1 | 104.9,71.4 104.9,70.6 104.23,69.94 IC12.7 | C18.1 96.5,49.94 v96.5,50.4 | R54.1 24.55,21.55 v24.9,21.9 | C40.1 41.83,42.03 42.2,42.4 44.75,42.4 | 44.75,42.6 44.95,42.6 | IC12.8 104.7,71.2 104.9,71.4
  Top 0.5: U$1.P$1 C61.1 16.68,67.25 C62.1 16.53,68.23 R22.1 15.94,68.46 15.4,69 15.2,69.2 | C86.2 71,81.62 71,83.7 v71.9,84.6 | v51.7,84.6 51.5,84.4 51.5,82.4 52.05,81.85 53.85,81.85 54.77,80.92 C83.1 | v39.9,84.6 v40.9,84.6 v41.9,84.6 41.95,84.65 42.5,84.65 | 114.2,82.5 v113.5,83.2 113.6,83.1 114.2,83.1 | 111.5,29.1 111.05,29.1 v111,29.15 | R9RU.1 111.5,29.1 | 111.5,29.1 111.5,29.3 114.4,29.3 v114.5,29.2 114,29.2 R9TU.1 | X5.1 101.8,65 v102.9,66.1 v103.9,66.1
  Top 0.7: U$1.P$1 18.44,65.36 19.7,64.1 23.9,64.1 | v53,46.72 52.6,46.72 45.7,46.72 45.6,46.82 | 23.9,64.1 23.9,57.7 23.9,56.4 26.85,53.45 28.1,52.2 40.15,52.2 40.22,52.2 45.6,46.82 | 23.9,64.1 24.6,64.1 28,67.5 46.87,67.5 47.8,68.43 v47.8,68.7 47.65,68.7 47.55,68.8 R43.1 47.55,71.5 41.4,77.65 41.4,84.1 v41.9,84.6 | RBTN5.1 42.75,84.6 v39.9,84.6 | 44.75,42.6 44.75,42.4 44.75,40.21 47.6,37.36 v47.6,31.4 v47.6,30.3 | 44.95,42.6 44.95,46.17 45.6,46.82 | X3.1 104.95,73.96 104.95,71.85
  Bottom 0.25: v51.4,69.3 49.2,69.3 48.6,68.7 v47.8,68.7 | v117,78.1 117,80 | v63.9,76.5 62.7,75.3 62.7,69.6 v62.8,69.5 | v94.4,68.55 96.15,70.3 104.5,70.3 | R17.1 124.5,67.5 124.5,70.4 | v124.6,84.1 124.5,84 124.5,70.4 | v124,70 124.4,70.4 124.5,70.4
  Bottom 0.4: 89.4,24.3 v89.5,24.2 | v114.5,29.2 115.7,29.2 R47.1 | 71.75,56.15 75.3,52.6 75.3,49.2 74,47.9 73.8,47.9 | 71.75,56.15 v65.4,62.5 | 73.8,47.9 73.8,45.8 77.7,41.9 v78.7,41.9 v85.2,41.9 | 71.75,56.15 75.5,59.9 v80.3,59.9 80.4,59.9 89.9,50.4 92.94,50.4 93.12,50.58 96.5,50.58 v96.5,50.4 | v66.2,41.4 66.2,43.3 70.8,47.9 | 70.8,47.9 73.8,47.9 | v63.3,51.91 63.3,52.7 | 63.3,52.7 v63.3,54.4 | v63.3,54.4 | 63.3,52.7 60.9,52.7 54.9,46.7 v54.2,46.7 53.02,46.7 v53,46.72 | 63.3,52.7 67.3,52.7 70.8,49.2 70.8,47.9 | v114.1,82.5 113.35,81.75 113.25,81.75 | v113.5,83.2 112.75,82.45 112.55,82.45 | 104.5,70.3 104.5,74.41 X3.1
  Bottom 0.5: v21.9,84.7 24.38,84.7 25.25,85.57 28.75,85.57 29.62,84.7 31.7,84.7 v31.8,84.6 34.27,84.6 35.24,85.57 38.76,85.57 39.73,84.6 40,84.6 | v102.9,66.1 v103.9,66.1 104.5,66.7 104.5,70.3
  Bottom 0.7: 40,84.6 v41.9,84.6 44.13,84.6 45.2,85.67 48.8,85.67 49.87,84.6 v51.7,84.6 54.13,84.6 55.2,85.67 58.8,85.67 59.87,84.6 v61.9,84.6 64.13,84.6 65.2,85.67 68.8,85.67 69.87,84.6 v71.9,84.6 74.13,84.6 75.2,85.67 78.8,85.67 79.87,84.6 v81.9,84.6 84.13,84.6 85.2,85.67 88.8,85.67 89.87,84.6 v91.9,84.6 94.13,84.6 95.2,85.67 98.8,85.67 99.87,84.6 v101.9,84.6 104.13,84.6 105.2,85.67 108.94,85.67 111.9,82.7 | 111.9,82.7 111.91,82.7 104.31,75.1 X3.1 | J12.4 118.6,80 117,80 115.01,80 113.25,81.75 112.55,82.45 112.1,82.9 111.9,82.7 | v47.6,31.4 v47.6,30.3 47.6,28.6 | 47.6,28.6 55.9,28.6 | v56,28.5 55.9,28.6 | 47.6,28.6 v36.1,28.6 32.6,25.1 28.1,25.1 v24.9,21.9 | 55.9,28.6 65.2,28.6 v69.5,24.3 v79.5,24.3 89.4,24.3 v99.5,24.3 100.4,24.3 105.7,29.6 110.55,29.6 v111,29.15
+4.1V  (via drill 0.35)
  Top 0.25: C15.1 C16.1 101.22,41.12 102.89,42.79 IC1.8 | C15.1 98.27,41.09 C17.1 | IC1.5 101.39,43.55 100.75,42.91 100.75,42.7 99.79,41.74 C15.1
  Top 0.3: IC11.2 22.39,69.31 22.6,69.1 22.31,68.81 IC11.1
  Top 0.4: C17.1 96.8,39.94 96.8,35.2 98.1,33.9 104.2,33.9 108,30.1 v108,28.2 v108,27.1 | U$1.P$2 20.18,66.88 v20.2,66.9
  Top 0.5: R20.1 23.19,68.51 | 22.6,69.1 23.19,68.51 | 23.19,68.51 23.29,68.41 22.95,68.07 C36.1 22.3,66.7 C35.1 22.21,66.27 20.28,66.27 U$1.P$2
  Bottom 0.4: v20.2,66.9 v20.2,65.4 17.6,62.8 4.22,62.8 2.6,61.18 2.6,31.94 16.74,17.8 23.4,17.8 27.7,22.1 104.4,22.1 108,25.7 v108,27.1 v108,28.2
+4V  (via drill 0.35)
  Top 0.25: C67.2 89.33,43.94 89.33,44.59 C69.2 89.45,44.7 88.6,44.7 88.6,46.1 88.6,47.6 89.06,48.06 IC8.1 | C60.2 116.54,38.19 IC2.1 116.54,40.3 118.44,40.3 IC2.3 | v116.41,38.32 v115.5,38.32
  Top 0.4: IC10.5 13.06,60.34 | 13.06,60.34 R18.1 | C32.2 14.57,61.51 C33.2 14.54,60.34 13.06,60.34 | IC3.3 19.05,61.2 19.57,61.72 C53.2 20.68,62.12 C55.2 20.7,61.54 20.95,61.29 IC3.1 | C58.2 115.2,38.62 v115.5,38.32 | C60.2 v116.41,38.32 | C67.2 89.73,42.77 v90.1,42.4 v90.7,41.8 | v15.6,64.4 16.2,64.4 v16.6,64.4
  Top 0.5: C53.2 18.09,63.6 16.1,63.6 | C32.2 15.14,61.54 16.1,62.5 16.1,63.6 | 16.1,63.6 16.1,64.3 16.2,64.4 | v16.6,64.4 v15.6,64.4
  Bottom 0.4: v116.41,38.32 v115.5,38.32 | v115.5,38.32 113.42,38.32 111.7,36.6 111.7,35.9 109.1,33.3 99.4,33.3 90.9,41.8 v90.7,41.8 | v115.5,38.32 116.38,38.32 121.5,33.2 121.5,18.35 119.6,16.45 118.4,16.45 114.15,20.7 28.25,20.7 26.28,18.73 26.23,18.73 23.8,16.3 16.2,16.3 1.2,31.3 1.2,61.8 3.78,64.38 5.2,64.38 5.22,64.4 v15.6,64.4 v16.6,64.4 | v90.1,42.4 v90.7,41.8 | v90.7,41.8 90.8,41.8
+12V
  Top 0.5: J11.1 15.8,88.45 15.8,80.7 | IC14.3 15.8,80.7 | C88.+ 16.57,80.7 15.8,80.7
ADC_BCLK  (via drill 0.35)
  Top 0.25: v71.8,51.5 72,51.7 74.61,51.7 79.31,47 U1.52 | IC5.6 38.7,42.4 v41,42.4
  Bottom 0.25: v41,42.4 42.47,42.4 49.4,49.33 49.4,57.83 51.97,60.4 63.45,60.4 71.67,52.18 71.67,51.63 v71.8,51.5
ADC_DOUT  (via drill 0.35)
  Top 0.25: IC5.2 40.18,39.83 v40.53,40.17 | v71.07,51.9 71.27,52.1 74.78,52.1 78.88,48 U1.54
  Bottom 0.25: v40.53,40.17 40.81,40.17 49.8,49.17 49.8,57.67 52.13,60 63.28,60 70.87,52.42 70.87,52.1 v71.07,51.9
ADC_LRCLK  (via drill 0.35)
  Top 0.25: v40.5,41.17 39.8,40.48 IC5.3 | U1.51 79.25,46.5 74.45,51.3 72.75,51.3 v72.55,51.1
  Bottom 0.25: v40.5,41.17 40.4,41.27 40.4,42.65 40.75,43 42.5,43 49,49.5 49,58 51.8,60.8 63.61,60.8 72.4,52.02 72.4,51.25 v72.55,51.1
ADC_MCLK  (via drill 0.35)
  Top 0.25: v40.5,39.2 38.7,39.2 IC5.1 | v70.27,52.17 70.6,52.5 U1.63
  Bottom 0.25: v40.5,39.2 40.5,39.3 50.2,49 50.2,57.5 52.3,59.6 63,59.6 70.27,52.33 v70.27,52.17
BTN1  (via drill 0.35)
  Top 0.25: IC6.29 52.38,74.05 49.62,76.82 49.62,79.5 v49.52,79.6
  Top 0.5: RBTN1.2 24.68,82.95 BTN1.B2 24.2,83.43 24.2,84.9 25.3,86 25.3,88.68 BTN1.B1
  Bottom 0.25: v49.52,79.6 49.32,79.8 36.7,79.8 36.2,80.3 27.33,80.3 BTN1.B2
BTN2  (via drill 0.35)
  Top 0.25: IC6.26 52.58,75.55 51.15,76.98 51.15,78.09 51.62,78.57 51.62,80 v51.23,80.4
  Top 0.5: RBTN3.2 34.68,82.95 BTN2.B2 34.2,83.43 34.2,84.9 35.3,86 35.3,88.68 BTN2.B1
  Bottom 0.25: BTN2.B2 37.03,80.6 51.02,80.6 v51.23,80.4
BTN3  (via drill 0.35)
  Top 0.25: IC6.20 57.25,78.7 v56,79.95
  Top 0.5: RBTN5.2 44.68,82.95 BTN3.B2 44.2,83.43 44.2,84.9 45.3,86 45.3,88.68 BTN3.B1
  Bottom 0.25: BTN3.B2 46.23,81.4 54.55,81.4 v56,79.95
BTN4  (via drill 0.35)
  Top 0.25: IC6.18 58.25,79.75 v56.7,81.3
  Top 0.5: RBTN7.2 54.68,82.95 BTN4.B2 54.2,83.43 54.2,84.9 55.3,86 55.3,88.68 BTN4.B1
  Bottom 0.25: v56.7,81.3 55.1,82.89 BTN4.B2
BTN5  (via drill 0.35)
  Top 0.25: v59.3,81.3 59.25,81.25 IC6.16
  Top 0.5: RBTN9.2 64.68,82.95 BTN5.B2 64.2,83.43 64.2,84.9 65.3,86 65.3,88.68 BTN5.B1
  Bottom 0.25: v59.3,81.3 60.9,82.89 BTN5.B2
BTN6  (via drill 0.35)
  Top 0.25: v60.7,80.5 60.25,80.05 IC6.14
  Top 0.5: RBTN11.2 74.68,82.95 BTN6.B2 74.2,83.43 74.2,84.9 75.3,86 75.3,88.68 BTN6.B1
  Bottom 0.25: BTN6.B2 73.25,81.4 61.6,81.4 v60.7,80.5
BTN7  (via drill 0.35)
  Top 0.25: IC6.12 63.05,76.05 63.1,76.1 63.1,78 62.7,78.4 62.7,79.8 v62.8,79.9
  Top 0.5: RBTN13.2 84.68,82.95 BTN7.B2 84.2,83.43 84.2,84.9 85.3,86 85.3,88.68 BTN7.B1
  Bottom 0.25: v62.8,79.9 63.5,80.6 83.3,80.6 84.74,82.04 BTN7.B2
BTN8  (via drill 0.35)
  Top 0.25: IC6.3 63.77,71.55 v64.17,71.95
  Top 0.5: RBTN15.2 94.68,82.95 BTN8.B2 94.2,83.43 94.2,84.9 95.3,86 95.3,88.68 BTN8.B1
  Bottom 0.25: BTN8.B2 94.74,82.04 93.7,81 85.41,81 83.81,79.4 67,79.4 64.5,76.9 64.5,72 64.45,71.95 v64.17,71.95
BTN9  (via drill 0.35)
  Top 0.25: IC6.2 63.3,71.05 64.4,71.05 v64.57,71.23
  Top 0.5: RBTN17.2 104.68,82.95 BTN9.B2 104.2,83.43 104.2,84.9 105.3,86 105.3,88.68 BTN9.B1
  Bottom 0.25: v64.57,71.23 64.57,71.51 64.9,71.84 64.9,76.74 67.16,79 83.98,79 85.58,80.6 98.4,80.6 100.08,82.28 104.12,82.28 BTN9.B2
COM_RX  (via drill 0.35)
  Top 0.25: v87.75,77.45 86.3,76 77,76 71.58,70.58 71.58,64.07 72.58,63.07 72.58,62.1 72.7,61.98 U1.87
  Bottom 0.25: X3.4 96.19,76.21 95.2,77.2 89.45,77.2 89.05,76.8 88.35,76.8 87.75,77.4 v87.75,77.45
COM_TX  (via drill 0.35)
  Top 0.25: U1.86 73.2,62.05 72.97,62.27 72.97,63.6 72.5,64.08 72.14,64.08 71.97,64.24 71.97,70.38 77.2,75.6 86.85,75.6 v88.7,77.45
  Bottom 0.25: v88.7,77.45 88.9,77.65 96.18,77.65 X3.3
DAC_LRCK  (via drill 0.35)
  Top 0.25: v78.3,58.8 77.7,59.4 U1.77 | IC1.40 97.96,45.06 v97.4,44.5
  Bottom 0.25: v97.4,44.5 97.6,44.7 97.6,45.7 94.8,48.5 86.83,48.5 78.73,56.61 78.73,57.48 78.93,57.68 78.93,58.17 v78.3,58.8
DAC_MCLK  (via drill 0.35)
  Top 0.25: U1.64 80.3,53 83.38,53 v83.94,52.44 | IC1.37 97.67,46.56 v97.27,46.96
  Bottom 0.25: v97.27,46.96 95.33,48.9 87,48.9 83.94,51.96 v83.94,52.44
DAC_NRST  (via drill 0.35)
  Top 0.25: IC1.32 97.84,49.06 v97.6,49.3 | v84.9,52.4 83.8,53.5 U1.65
  Bottom 0.25: v97.6,49.3 87.16,49.3 84.9,51.56 v84.9,52.4
DAC_SCL  (via drill 0.35)
  Top 0.25: IC1.2 99.89,43.59 99.38,43.08 96.22,43.08 v95.05,44.25 | R62.2 68.7,62.45 U1.95 68.77,60.18 68.77,59.54 70.41,57.9 v76.3,57.9
  Bottom 0.25: v95.05,44.25 95.05,44.4 95.5,44.85 95.5,46.03 94.23,47.3 86.33,47.3 76.53,57.1 76.53,57.38 76.3,57.62 v76.3,57.9
DAC_SCLK  (via drill 0.35)
  Top 0.25: v78.33,57.93 77.2,59.05 U1.78 | IC1.38 97.2,46.06 96.54,45.4 v96.5,45.4
  Bottom 0.25: v96.5,45.4 96.5,46.23 94.63,48.1 86.67,48.1 78.33,56.44 v78.33,57.93
DAC_SDA  (via drill 0.35)
  Top 0.25: R63.2 66.9,62.2 67.1,62 68,62 68.2,61.8 U1.96 68.27,60.18 68.27,59.47 70.25,57.5 75.57,57.5 v75.93,57.13 | IC1.1 99.39,43.66 99.22,43.48 96.67,43.48 95.05,45.1 v94.9,45.1
  Bottom 0.25: v94.9,45.1 94.9,46.07 94.07,46.9 86.17,46.9 v75.93,57.13
DAC_SDIN  (via drill 0.35)
  Top 0.25: U1.80 76.2,60 76.2,59 v77.3,57.9 | IC1.39 97.56,45.56 v96.5,44.5
  Bottom 0.25: v96.5,44.5 95.9,45.1 95.9,46.2 94.4,47.7 86.5,47.7 77.3,56.9 v77.3,57.9
EN1A  (via drill 0.35)
  Top 0.25: R54.2 20.95,18.5 15.4,18.5 14.1,19.8 14.1,24.07 11.58,26.58 11.58,26.6 | VR2.A1 11.58,26.88 11.58,26.6 | 11.58,26.6 10.3,27.88 10.3,29.8 7.9,32.2 7.9,43.5 9.4,45 v10,45 | IC6.43 58.25,69.9 58.15,70 58.15,71.4 v58.25,71.5
  Bottom 0.25: v10,45 10.2,45.2 17.43,45.2 31.31,59.08 33,59.08 36.34,62.42 36.34,64.55 42.1,70.3 52.84,70.3 54.54,72 56.5,72 57.2,71.3 58.05,71.3 v58.25,71.5
EN1B  (via drill 0.35)
  Top 0.25: 8.65,28.95 13.7,23.9 13.7,19.63 15.23,18.1 22.25,18.1 R52.2 | 8.65,28.95 VR2.B1 | 8.65,28.95 7.5,30.1 7.5,43.7 v9.4,45.6 | IC6.42 57.75,70.3 57.45,70.6 v57.45,71.9
  Bottom 0.25: v9.4,45.6 17.27,45.6 31.14,59.48 32.84,59.48 35.94,62.58 35.94,64.71 41.93,70.7 52.68,70.7 54.38,72.4 56.95,72.4 v57.45,71.9
EN1PB  (via drill 0.35)
  Top 0.25: R53.2 22.15,17.7 15.07,17.7 | 15.07,17.7 13.3,19.47 13.3,23.64 7.1,29.84 7.1,43.87 8.6,45.37 v8.6,45.65 | VR2.1 14.1,16.73 15.07,17.7 | v56.87,73.8 57.15,73.8 57.8,73.15 60.36,73.15 61.46,72.05 IC6.4
  Bottom 0.25: v56.87,73.8 54.08,73.8 52.18,71.9 41.43,71.9 34.74,65.21 34.74,63.65 17.3,46.2 9.15,46.2 v8.6,45.65
EN2A  (via drill 0.35)
  Top 0.25: R51.2 31.2,55 32,55.8 VR1.A1 32,56.6 32.02,56.62 v32.02,60.08 | IC6.11 59.9,75.55 v58.5,74.15
  Bottom 0.25: v58.5,74.15 57.55,73.2 54.05,73.2 52.35,71.5 41.6,71.5 35.15,65.04 35.15,63.48 32.02,60.36 v32.02,60.08
EN2B  (via drill 0.35)
  Top 0.25: R49.2 37.6,54.9 37,55.5 VR1.B1 37,56.5 33.21,60.29 v33.21,60.69 | IC6.10 60.15,75.05 59.35,74.25 v59.35,74.15
  Bottom 0.25: v59.35,74.15 58,72.8 54.21,72.8 52.51,71.1 41.77,71.1 35.54,64.88 35.54,63.31 33.21,60.98 v33.21,60.69
EN2PB  (via drill 0.35)
  Top 0.25: VR1.1 32.1,70.9 32.1,74.58 R50.2 35.95,77.05 v35.95,79.7 | IC6.27 52.51,75.05 50.75,76.82 50.75,79.32 v51.02,79.6
  Bottom 0.25: v51.02,79.6 50.42,79 49.27,79 48.87,79.4 36.25,79.4 v35.95,79.7
F1_CLK
  Top 0.25: U$2.SCK 47,53.5 47.35,53.85 47.35,65.48 49.17,67.3 55.43,67.3 56.25,68.12 IC6.39
F1_MISO
  Top 0.25: IC6.40 56.75,68.05 55.6,66.9 49.33,66.9 47.75,65.32 47.75,50.27 U$2.MISO
F1_MOSI  (via drill 0.35)
  Top 0.25: IC6.41 57.25,67.99 55.76,66.5 49.5,66.5 48.15,65.15 48.15,56.2 v48.35,56
  Bottom 0.25: v48.35,56 48.31,56.04 U$2.MOSI
F1RST  (via drill 0.35)
  Top 0.152: 11.15,55.8 C46.1
  Top 0.25: J13.10 6.94,55.8 7.7,55.8 | 7.7,55.8 11.15,55.8 | v57.6,74.2 58.25,73.55 IC6.7 | v7.7,54.6 7.7,55.8 | R59.1 27.15,57.05 v27.2,57
  Bottom 0.25: v57.6,74.2 57.4,74.4 54.12,74.4 52.02,72.3 41.27,72.3 34.34,65.38 34.34,63.84 27.35,56.85 | v27.2,57 27.35,56.85 | 27.35,56.85 17.1,46.6 9.03,46.6 8,47.63 8,54.3 v7.7,54.6
F1SWCLK  (via drill 0.35)
  Top 0.25: IC6.37 55.25,68.25 55.1,68.1 50,68.1 49.2,68.9 49.2,72.83 v49.12,72.9 | v9.2,59.6 9.17,59.57 J13.4
  Bottom 0.25: v49.12,72.9 49.12,72.7 | 49.12,72.7 51.8,72.7 54.1,75 R55.1 | v9.2,59.6 9.4,59.4 9.4,55.3 8.4,54.3 8.4,47.8 9.2,47 16.83,47 26.3,56.47 26.3,57.05 27.05,57.8 27.73,57.8 33.94,64.01 33.94,65.54 41.1,72.7 49.12,72.7
F1SWDIO  (via drill 0.35)
  Top 0.25: J13.2 9.76,60.84 v9.8,60.8 | IC6.34 52.4,71.55 50.65,73.3 v50.5,73.3
  Bottom 0.25: R60.1 52.4,73.87 52.02,73.5 50.5,73.5 | v9.8,60.8 9.8,55.13 8.8,54.13 8.8,47.97 9.37,47.4 16.6,47.4 25.9,56.7 25.9,57.31 26.79,58.2 27.57,58.2 33.54,64.18 33.54,65.71 40.94,73.1 48.48,73.1 48.88,73.5 50.5,73.5 | v50.5,73.3 50.5,73.5
F1USB_D+  (via drill 0.35)
  Top 0.25: v9.2,71.3 8.9,71 8.9,70.33 6.27,67.7 J10.3 | IC6.33 52.6,72.05 50.67,73.98 50.45,73.98 50.1,74.33 v50.1,75.28
  Bottom 0.25: v9.2,71.3 9.2,71.53 12.67,75 19.07,75 22.07,78 48.37,78 50.1,76.27 v50.1,75.28
F1USB_D-  (via drill 0.35)
  Top 0.25: J10.2 6.22,68.35 8.3,70.43 v8.3,71.4 | IC6.32 52.73,72.55 v50.7,74.58
  Bottom 0.25: v8.3,71.4 12.3,75.4 18.9,75.4 21.9,78.4 48.63,78.4 50.7,76.33 v50.7,74.58
F4RST  (via drill 0.35)
  Top 0.25: J14.10 130.34,72.34 130.2,72.2 130.2,70.4 129.25,69.45 C101.1 127.1,69.45 R16.1 126.05,68.4 108.67,68.4 | 108.67,68.4 v107.4,68.4 | 108.67,68.4 v108.47,68.6 | v66.32,67.32 67.12,66.53 69.46,66.53 70.55,65.44 70.55,64.34 v70.75,64.14 | v61.8,63.8 61.8,59.2 v62,59 | v67.08,54.68 67.08,53.48 65.6,52 U1.14
  Bottom 0.25: v108.47,68.6 107.75,67.88 107.67,67.88 107.32,67.53 107.32,66.96 105.95,65.6 105.22,65.6 104.72,65.1 95.65,65.1 94.85,65.9 92.72,65.9 92.32,65.5 89.21,65.5 88.81,65.9 87.99,65.9 87.19,65.1 79.65,65.1 79.25,65.5 78.55,65.5 78.15,65.1 76.15,65.1 75.35,64.3 70.9,64.3 v70.75,64.14 | v66.32,67.32 66.17,67.32 65.05,66.2 64.2,66.2 v61.8,63.8 | v62,59 63.03,59 67.08,54.96 v67.08,54.68
F4SPI_CLK  (via drill 0.35)
  Top 0.25: U1.89 71.7,61.21 71.78,61.29 71.78,62.34 71.02,63.1 70.95,63.1 v70.75,63.3 | v105.8,64.2 105.8,64.3 | 105.8,64.3 105.8,67.1 104.23,68.67 IC12.6 | v111.4,58.7 110.64,58.7 109.8,59.53 108.86,59.53 106.42,61.98 106.42,63.68 105.8,64.3
  Bottom 0.25: v70.75,63.3 71.35,63.9 93.65,63.9 94.15,64.4 94.65,64.4 95.15,63.9 105.3,63.9 105.6,64.2 v105.8,64.2 106.53,64.2 109.58,67.24 109.58,68.18 118.14,76.75 119.55,76.75 120.3,77.5 120.3,81.95 119.62,82.62 J12.5 | U$2.SCK_SD 110.72,56.02 111.4,56.7 v111.4,58.7
F4SPI_MISO  (via drill 0.35)
  Top 0.25: U1.90 71.2,61.28 71.38,61.46 71.38,61.95 70.83,62.5 v70.77,62.5 | v94.4,63.8 94.4,64.8 93.8,65.4 93.8,68.9 94.83,69.94 IC12.2 | U$2.MISO_SD 109.1,58.56 105.82,61.84 v105.82,63.38
  Bottom 0.25: v70.77,62.5 70.97,62.7 71,62.7 71.8,63.5 94.3,63.5 94.4,63.6 v94.4,63.8 94.4,63.5 105.8,63.5 105.82,63.48 v105.82,63.38 106.28,63.38 109.97,67.08 109.97,68.01 117.86,75.9 119.87,75.9 121.1,77.13 121.1,86.2 119.75,87.55 J12.7
F4SPI_MOSI  (via drill 0.35)
  Top 0.25: U1.91 70.7,61.62 v70.78,61.7 | v105.1,62.8 105.2,62.9 105.2,66.3 104.11,67.39 IC12.5
  Bottom 0.25: v70.78,61.7 70.98,61.9 71.02,61.9 72.21,63.1 103.4,63.1 103.9,62.6 104.9,62.6 | J12.2 117.66,75.12 110.38,67.84 110.38,64.7 | 104.9,62.6 106.4,62.6 108.5,64.7 110.38,64.7 | 104.9,62.6 v105.1,62.8 | U$2.MOSI_SD 110.38,62.08 110.38,64.7
F4SWCLK  (via drill 0.35)
  Top 0.25: J14.4 126.75,68.53 126.22,68 108.64,68 v107.92,67.28 | v78.8,64.9 78.2,64.3 U1.76
  Bottom 0.25: v78.8,64.9 79,64.7 87.35,64.7 88.15,65.5 88.65,65.5 89,65.15 89,65.1 92.49,65.1 92.89,65.5 94.68,65.5 95.48,64.7 104.89,64.7 105.39,65.2 106.12,65.2 107.92,67 v107.92,67.28
F4SWDIO  (via drill 0.35)
  Top 0.25: J14.2 132.46,67.6 110.8,67.6 109.09,67.6 v108.89,67.4 | U1.72 84.13,57 88.6,61.47 88.6,64.7 v88.4,64.9
  Bottom 0.25: v88.4,64.9 88.6,64.7 92.65,64.7 93.05,65.1 94.51,65.1 95.31,64.3 105.05,64.3 105.55,64.8 106.29,64.8 v108.89,67.4
GND  (via drill 0.35)  (10 unrouted)
  Top 0.25: IC6.35 51.08,71.05 C82.2 | C19.2 96.61,46.92 96.61,47.15 97.02,47.56 IC1.35 100.04,47.56 v100.2,47.4 | C7.2 105.22,52.38 v105.2,52.4 | C10.2 109.41,51.09 v108.1,52.4 | R2.1 111.61,48.81 110.81,48.01 110.41,48.01 v110.2,47.8 110.01,47.99 C23.2 109.34,47.99 108.52,48.8 107.25,48.8 106.5,48.06 IC1.17 103.54,48.06 103.4,48.2 103.3,48.1 v103.3,47.4 | C81.2 65.04,74.14 65.02,74.14 64.88,74 v63.7,74 63.65,74.05 IC6.8 | C22.2 109.02,44.52 v109,44.5 | IC1.41 101.59,47.31 v100.1,48.8 | IC1.3 100.39,45.51 v100.1,45.8 | IC4.6 12.64,69.86 IC4.9 | IC11.6 19.59,69.81 19.84,69.56 IC11.9 | C66.1 94.45,46.86 C65.1 93.66,45.41 C68.1 | C24.2 112.15,41.9 v111.7,41.9 | v67.1,49.7 67.4,49.4 67.55,49.4 67.9,49.05 67.9,48.55 67.55,48.2 66,48.2 65.8,48.4
  Top 0.3: U1.20 65.2,49 65.8,48.4
  Top 0.4: IC7.11 39.5,32.6 38.95,32.05 C27.2 | IC9.11 59.5,32.6 58.95,32.05 C75.2 | IC13.11 88.5,35.1 87.95,34.55 C85.2 | J10.5 5.9,66.4 6.2,66.1 6.2,65.1 5,65.1 J10.7
  other vias: 5.5,28 2,31.5 26,19.4 27.6,21 29.6,21.4 111,46.2 8.5,77.5 1.8,83.5 1.4,90.2 2.7,93 11.2,94 23.8,93.1 20.5,93.2 18.2,91.5 22.2,90.6 2.9,68.7 2.9,66.8 12.4,70.5 13.4,70.5 13.4,68.7 12.4,68.7 12.9,69.6 19.7,70.5 20.7,70.5 20.7,68.6 19.7,68.6 20.2,69.5 16.8,74.1 15.2,76 20.2,75.2 22.3,77.3 23.7,79 26.2,77.4 28.6,79 31.2,77.4 33.5,79 41.2,76.4 43.5,77.3 42.6,81.7 32.2,93.3 32.2,90.7 42.3,93.3 42.3,90.9 52.2,93.3 52.2,90.7 62.1,93.3 62.1,90.8 72.2,93.2 72.3,90.9 82.1,93.1 82.1,90.8 92.1,93.3 92.1,90.8 102.4,93.4 102.3,90.6 29.8,71.3 26.7,74.2 25.2,73.2 27.3,71.1 29.7,68.5 27.1,67.9 24.1,65 21.2,65 22,67.5 22.9,73.3 18.7,73.4 18.1,67.2 12.2,72.1 11.7,75.8 10.2,74.3 9.7,70.4 14.3,67.2 13.9,65.2 17.6,65 21.8,63.2 22.9,60.9 23.4,55.3 25.8,52.7 29.9,56.7 34.8,59.6 36.8,61.8 33.2,66.5 41.5,68.6 43.3,74 49.5,74.1 37.7,81.4 5.7,61.9 12.1,61.9 12.2,57 14.8,57.8 15.8,60.8 20.1,59.3 20.8,52.7 11.6,44.4 16.5,44.3 20,46.5 23.1,49.5 13.7,48.2 28.3,53.6 6.1,36.3 8.6,39.1 8,25.5 10.6,22.9 12.7,20.8 12.7,26.7 20.5,19.2 21.6,15.6 17.4,15.4 13,18.2 27.2,48 33.2,45.2 37.2,45.2 37.2,39 33.1,39 35.2,42 26.9,43.3 27.1,41 28.5,33.9 43.1,47.7 39.8,51.1 33.4,51.1 39.3,53.2 43.1,51 48.2,49.7 50,47.6 48.1,45.6 45.5,38 51.7,43.1 25.2,37.3 24.1,32.7 27.3,28.6 30.3,24.1 30.3,26.2 25.9,21.6 27.6,23.1 25.8,16.5 27.5,17.8 37.3,21.4 42.2,21.4 47.3,21.4 52,21.4 57,21.4 62.5,21.4 67,21.4 72,21.4 76.9,21.4 81.4,21.4 86.9,21.4 91.7,21.4 96.8,21.4 101.9,21.4 107.1,21.6 112.4,21.6 116.8,19.4 27,8.3 30.4,31.7 32.7,33.8 32.6,36.2 36.9,34.5 39.2,34.5 38,30.7 34.6,28.7 41.2,29.6 40.4,26.5 45.6,26.5 50.5,26.5 35.5,26.3 55.5,26.3 60.4,26.2 65.6,26.3 75.5,26.7 70.9,25.3 73,22.9 83,23 85.3,27.9 76.4,30.8 78.7,33 87,33 87,37 87,35.1 81.9,36 89.9,37.8 92.7,36.1 96.4,32.6 96.1,31.1 95.4,28.1 91,28 101,27.8 95.9,25.4 105.3,27.7 106.3,30.6 108.5,30.7 112.8,27.6 112.8,31 117.8,25.5 117.7,28.8 120.2,27.5 122.5,24.6 120.7,24.4 122.3,18.7 131.1,15.5 137.4,21 137.6,11 137.3,30.4 137.6,1.9 131.2,9.1 131,3.8 130.1,23.5 124.2,37.4 127.2,45 120.3,40 130,51.4 131.5,48.3 120.9,50.7 122.4,51.3 119.8,49.7 118.8,48.7 117.7,47.7 116.6,46.5 115.3,47.6 119.6,43.4 120.7,44.7 121.7,45.8 122.6,46.9 123.5,48 124.4,49.2 125,51.2 129.7,47.2 131.1,46.2 37.9,23 48,23.1 58.1,23.3 67.7,23.5 67.2,28.3 60.9,29.6 54.9,29.6 57.9,30.8 56.4,34.4 59.5,34.4 51.1,32.9 28.7,27.9 45.1,32.8 65.1,32.8 53.3,37.4 56.4,37.4 54.9,37.4 58,37.4 35.9,35.6 42.1,32.6 62,32.6 70.9,31 74.9,29.1 74.4,35 77,35 81.6,33.7 78.7,40.8 84.7,40.8 89.9,40.8 91.5,32.1 80.8,31.9 81.1,27.7 103.8,22.9 116.1,23.4 110.5,33.6 110.5,36 112.1,39.6 107.4,38.7 105.1,38.1 102.7,38.1 100.6,37.9 98.3,38 95.8,39.8 92.6,43 99.2,42.4 93.5,46.1 90.9,46.2 88.6,50.1 85.4,53.5 86.8,54.8 91.3,52.9 98.3,55.1 101.7,53.6 104.5,54.3 105,56.2 110.7,57.7 113.2,57.8 113.3,56 111.4,53.6 108.2,54.3 107.9,56.1 106.1,57.7 111.3,60.6 118.7,53.8 123.3,57.5 131.8,55.4 129.2,59 137.5,53.9 137.6,65.5 132.3,64.2 117.2,73.6 116,71.8 111.5,66.4 109.6,65.6 105.3,69.1 105.9,73.7 109.2,69 112.1,71.9 114,78.3 115.4,75 121.8,76 123.6,78.5 125.3,77.7 127.1,79 137.5,80.1 137.4,83.7 123.7,81.8 121.8,81.8 121.8,85 123.8,85 120.2,88.4 120.1,86 117.4,93.3 112,84.5 112.1,81.6 106.2,78.3 110.3,78.3 93.5,76.5 100,77.2 91.6,79.6 86.45,79.6 81.95,77.9 74.75,77.35 98.5,50.4 103.3,45.7 101.6,47.4 115.8,43.5 121.5,34.7 119.1,33.9 117.5,35.3 85.3,34.1 82.9,32.6 121.9,66 122.8,64.2 123.8,73.6 116.3,85 91.7,74.6 92.9,60.8 86.6,61.2 83.8,70 72,73.9 72.8,68.9 69.5,67.2 71.75,77.35 61.7,79.2 65.4,79.1 68.9,76.7 66.5,76 65.9,69.8 63.4,68.2 61.2,65.7 57.8,67.5 52.3,68.8 54.4,69.8 58.7,72.4 58.8,70.4 60.2,74.2 55.8,75.4 62.1,77 53.4,80.7 54.6,65.7 57.8,61.5 58.7,63 56.1,63.1 48.8,61.2 49.3,65.4 48.6,69.6 70.1,59.1 73.5,59.1 75.3,58.5 67.7,59 70.1,56.7 73.4,53.4 78.7,53.2 72.9,56.1 79.8,59.2 79.5,60.7 83.6,57.9 81.2,47.9 84.3,47.8 77.9,46.8 78.9,44 88.5,43.9 87.9,46.2 78.8,49.1 76.1,51.9 74.2,49.3 75.5,47.9 73,46.9 70,45.9 67.6,46 69.9,48.2 65.7,53.6 63.2,55.3 63.3,56.7 59.1,53.9 55.7,51 55.3,48.3 54.2,45.4 63.3,45.3 63.6,42.5 51.8,58.1 50.9,52.9 67.8,53.4 68.1,40.4 71.6,36.6 63.1,34.9 66.2,30.7 68.8,32.4 70.7,28.7 78.3,29.2 86.1,25.9 95.4,29.7 101,30.3 116.9,16.2 8.5,79.2 67.3,51.5 46.6,33 48.5,33.1 47.8,27.7 98.1,60.7 100.9,71.4 97.4,71.3 97.2,67.2 100.9,67.2 99.1,69.3 128,83.5 19.4,31.8 18.1,30.5 16.4,28.5 8.5,32.5 47.7,38.7 91.8,69.9 105.6,60.7 81.4,46.3 1.9,37.3 1.9,43.6 1.9,49.9 3.5,54.6 3.5,47.1 3.4,40.9 7.8,46.5 85.4,35.9 25.9,31.2 40.3,45.7 27.9,37.7 30.8,45.8 33,41.8 28.7,31.5 56,79.1 67.6,61.4 84.8,59.4 89.9,58.4 65.4,65.7 52,62.3 93.4,49.9 6.4,63.6 12.1,63.6 2.2,61.8 16.5,17 21.7,17 79.9,70 92.1,66.2 95.9,65.8 100.5,65.8 113.5,69.2 123.5,69 125.3,71 130.3,73.2 139.7,69.2 103.7,71.9 70.8,66.1 62.6,62.7 10.3,65.2 134.5,80.8
  pour Top: 148.3,106.2 -2.9,106.2 -2.9,-5.8 148.3,-5.8
  pour Bottom: 147.6,99 -8,99 -8,-5.2 147.6,-5.2
IN0A
  Top 0.25: IC7.3 34.93,33.12 30.69,33.12 29.5,31.93 C1R.1 30.98,30.48 R1R.1
IN0A2
  Top 0.25: IC9.3 53.23,33.25 C3R.1 51.88,34.6 50.17,34.6 49.4,33.83 49.4,31.2 50.15,30.45 R3R.1
IN0B
  Top 0.25: IC7.5 33.42,31.95 C1T.1 33.08,30.52 R1T.1
IN0B1
  Top 0.25: R7T.1 96.65,29.1 C7T.1 94.9,30.12 94.9,31.03 91.48,34.45 IC13.10
IN0B2
  Top 0.25: IC9.5 52.96,31.95 52.88,32.04 C3T.1 52.88,30.57 R3T.1
IN0B4
  Top 0.25: C5T.1 75.2,30.6 76.35,29.45 R5T.1 77,30 82.75,35.75 IC13.3
IN1A
  Top 0.25: IC7.10 42.98,31.95 C2R.1 43,31.98 R2R.1
IN1A2
  Top 0.25: IC9.10 62.98,31.95 C4R.1 63,31.98 R4R.1
IN1B
  Top 0.25: IC7.12 42.17,33.25 42.73,33.8 C2T.1 44.12,34.8 45.33,34.8 45.9,34.23 45.9,31.35 R2T.1
IN1B1
  Top 0.25: R8T.1 105.15,30.6 103.9,30.6 | 103.9,30.6 C8T.1 | IC13.12 91.55,35.75 95.4,31.9 103.3,31.9 103.9,31.3 103.9,30.6
IN1B2
  Top 0.25: IC9.12 61.98,33.25 62.52,33.8 C4T.1 64.03,34.7 65.8,34.7 66.1,34.4 66.1,31.55 R4T.1
INL
  Top 0.25: JADC.2 13.25,33.85 21.52,25.58 C49.2 22.75,24.04 C47.-
INR
  Top 0.25: JADC.3 16.8,33.3 20.78,29.32 C48.- 22.68,27.75 C50.2
KNOB1  (via drill 0.35)
  Top 0.25: U1.34 70.2,43.7 71.6,42.3 73.5,42.3 v73.6,42.2 | R15.2 121.2,9.4 121.2,12 120.1,13.1 C103.1 119,15.4 v119,18.1
  Bottom 0.25: v73.6,42.2 73.6,41.93 76.23,39.3 90.73,39.3 98.63,31.4 110.2,31.4 118.2,23.4 118.2,19 118.2,18.9 v119,18.1
KNOB2  (via drill 0.35)
  Top 0.25: C102.1 119.3,60 R17.2 | v72.9,43.6 71.51,43.6 71.2,43.91 U1.36 | v120.3,36.7 v115.8,32.2
  Bottom 0.25: R17.2 129.4,59.9 130.7,58.6 130.7,47.1 v120.3,36.7 | v72.9,43.6 73.61,43.6 74.6,42.61 74.6,42.07 76.57,40.1 91.17,40.1 99.07,32.2 v115.8,32.2
KNOB3  (via drill 0.35)